# Altium schematic sheet UI_Ticketing_Master.SchDoc
size A4; Organization: ETML-ES; Address1: Avenue Recordon 1; Address2: 1004 Lausanne; Address3: Switzerland
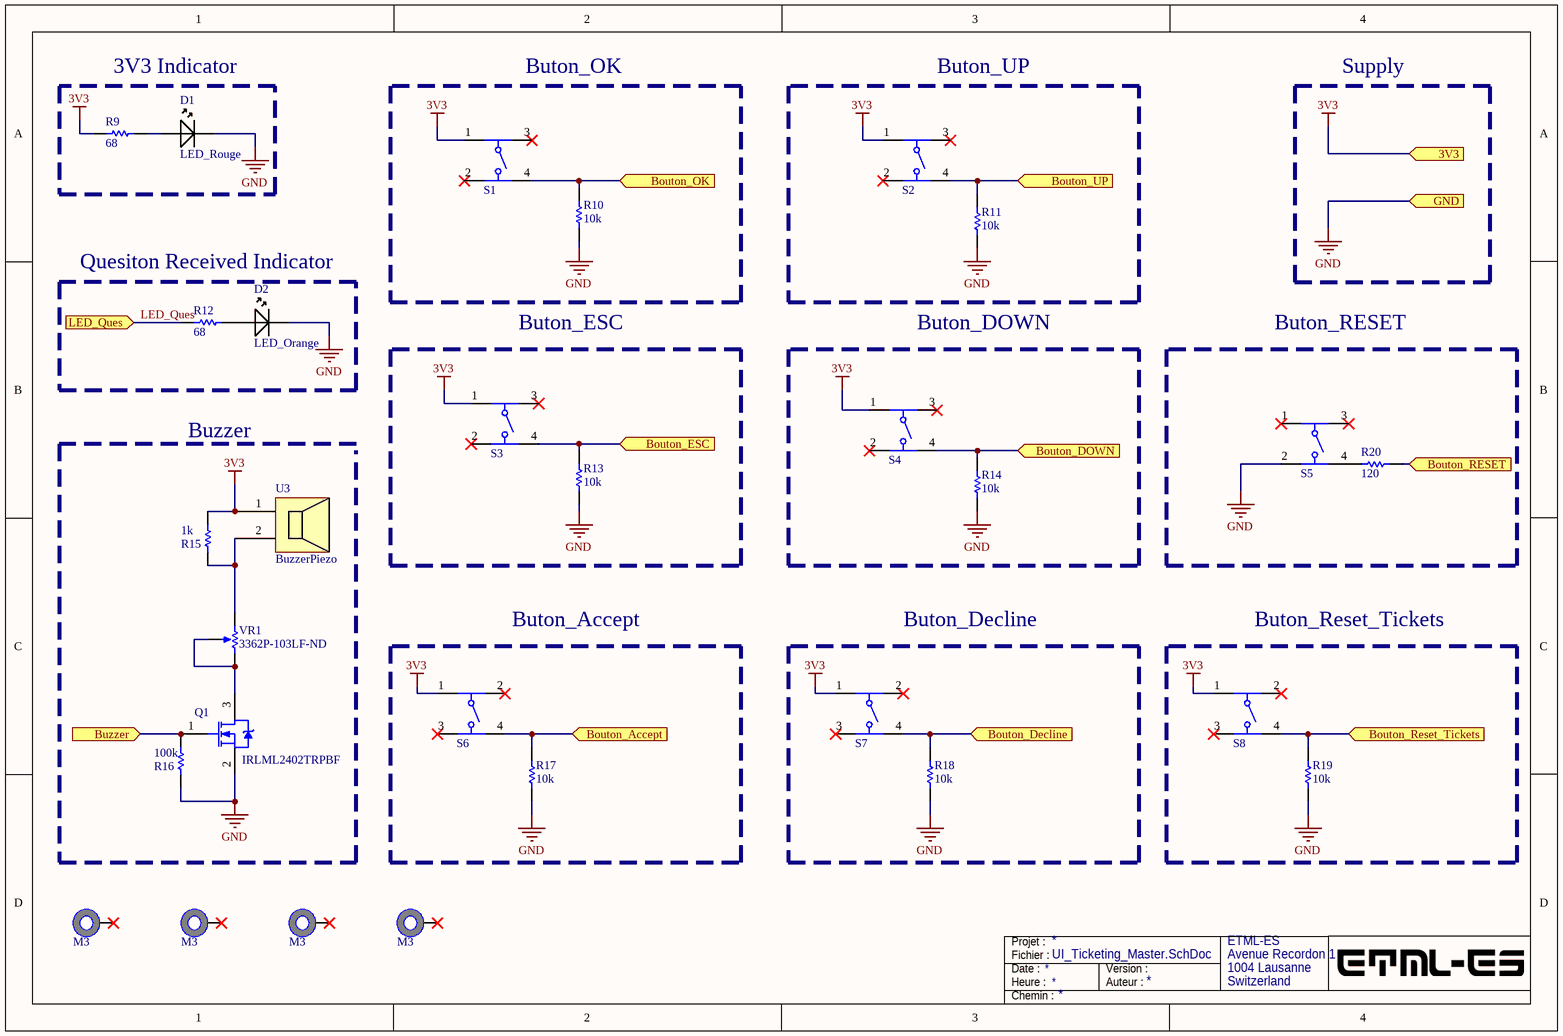
[diagram p0: UI_Ticketing_Master.SchDoc]

## Parts
(Parts that share a designator on the sheet are numbered #1, #2 ... from top to bottom, then left to right.)
?#1  M3  [9774010151]
?#2  M3  [9774010151]
?#3  M3  [9774010151]
?#4  M3  [9774010151]
D1  LED_Rouge  [LED-2P-2.28-3MM]
D2  LED_Orange  [Type 5mm]
Q1  IRLML2402TRPBF  [INTR-IRLML2402TRPBF-3_V]
R9  68  [RESC0805(2012)_L]
R10  10k  [RESC0805(2012)_L]
R11  10k  [RESC0805(2012)_L]
R12  68  [RESC0805(2012)_L]
R13  10k  [RESC0805(2012)_L]
R14  10k  [RESC0805(2012)_L]
R15  1k  [RESC2013X60X35ML10T20]
R16  100k  [RESC2013X60X35ML10T20]
R17  10k  [RESC0805(2012)_L]
R18  10k  [RESC0805(2012)_L]
R19  10k  [RESC0805(2012)_L]
R20  120  [RESC0805(2012)_L]
S1  430152095826  [430152095826]  (value not drawn)
S2  430152095826  [430152095826]  (value not drawn)
S3  430152095826  [430152095826]  (value not drawn)
S4  430152095826  [430152095826]  (value not drawn)
S5  430182050816  [430182050816]  (value not drawn)
S6  430466073726  [4304x60737x6_12x12x7.3]  (value not drawn)
S7  430466073726  [4304x60737x6_12x12x7.3]  (value not drawn)
S8  430466073726  [4304x60737x6_12x12x7.3]  (value not drawn)
U3  BuzzerPiezo  [Buzzer]
VR1  3362P-103LF-ND  [BOUR-3362P]

## Blocks framed on the sheet
3V3 Indicator: D1 R9
Buton_OK: R10 S1
Buton_UP: R11 S2
Quesiton Received Indicator: D2 R12
Buton_ESC: R13 S3
Buton_DOWN: R14 S4
Buton_RESET: R20 S5
Buton_Accept: R17 S6
Buton_Decline: R18 S7
Buton_Reset_Tickets: R19 S8

## Ports
3V3, Bouton_Accept, Bouton_Decline, Bouton_DOWN, Bouton_ESC, Bouton_OK, Bouton_RESET, Bouton_Reset_Tickets, Bouton_UP, Buzzer, GND, LED_Ques

## Nets
3V3: R9.2 R15.2 S1.1 S2.1 S3.1 S4.1 S6.1 S7.1 S8.1 U3.1 ; port 3V3
GND: D1.2(Cathode) D2.1(Cathode) Q1.2(S) R10.2 R11.2 R13.2 R14.2 R16.1 R17.2 R18.2 R19.2 S5.2 ; port GND
Bouton_Accept: R17.1 S6.4 ; port Bouton_Accept
Bouton_Decline: R18.1 S7.4 ; port Bouton_Decline
Bouton_DOWN: R14.1 S4.4 ; port Bouton_DOWN
Bouton_ESC: R13.1 S3.4 ; port Bouton_ESC
Bouton_OK: R10.1 S1.4 ; port Bouton_OK
Bouton_RESET: R20.2 ; port Bouton_RESET
Bouton_Reset_Tickets: R19.1 S8.4 ; port Bouton_Reset_Tickets
Bouton_UP: R11.1 S2.4 ; port Bouton_UP
Buzzer: Q1.1(G) R16.2 ; port Buzzer
LED_Ques: R12.2 ; port LED_Ques
NetD1_1: D1.1(Anode) R9.1
NetD2_2: D2.2(Anode) R12.1
NetQ1_3: Q1.3(D) VR1.2(S) VR1.3(CW)
NetR15_1: R15.1 U3.2 VR1.1(CCW)
NetR20_1: R20.1 S5.4

Not connected (* = marked no-connect by the designer): ?#1 1*; ?#2 1*; ?#3 1*; ?#4 1*; S1 2* 3*; S2 2* 3*; S3 2* 3*; S4 2* 3*; S5 1* 3*; S6 2* 3*; S7 2* 3*; S8 2* 3*

## Notes on the sheet
- Supply
- Buzzer
- Fichier :
- Date :
- Heure :
- Projet :
- Auteur :
- Version :
- Chemin :

## Library data of the parts
?#1-?#4 = 9774010151: WA-SMSI SMT Steel Spacer, M2.5 Thread Internal, Length 1mm; InnerDiameter: 3.5mm; OuterDiameter: 5.1mm; PublishedDate: Dec. 2016; Publisher: Wurth Elektronik; ComponentLink1Description: Manufacturer; ComponentLink1URL: http://www.we-online.de; ComponentLink2Description: Datasheet; ComponentLink2URL: http://katalog.we-online.de/em/datasheet/9774010151.pdf; PartNumber: 9774010151; Length: 1mm; Thread: M2.5; Packaging: Bulk
D1 D2 = LED: Supplier A: *; Supplier B: *; Supplier B Ref: *; Manufacturer URL: *; Manufacturer Ref: *; Package: *
  D1: Supplier A Ref: 754-1305-ND
  D2: Supplier A Ref: 754-1271-ND
Q1 = CMP-2000-05155-1: HEXFET(R) Power MOSFET, N-Channel, 20 V, 1.2 A, 3-Pin SOT-23, RoHS, Tape and Reel; Manufacturer: Infineon Technologies; PartNumber: IRLML2402TRBF; PackageCase: SOT-23; Supplier: Digi-key; Supplier PN: IRLML2402PBFCT-ND
R9-R14 R17-R19 = CMP-1013-00122-1: 100K 0.125W 5% 0805 (2012 Metric)  SMD; Case-Metric: 2012; Case-EIA: 0805; Tolerance: 5 %; Technology: SMT; Power: 0.125 W
  R9 R12: Value: 68
  R10 R11 R13 R14 R17-R19: Value: 10k
R15 = CMP-2100-03671-1: Chip Resistor, 1 KOhm, +/- 1%, 125 mW, -55 to 155 degC, 0805 (2012 Metric), RoHS, Tape and Reel; Voltage Rating: 150V; Value: 1kOhm; PackageCase: 0805
R16 = CMP-2100-03671-1: Chip Resistor, 100 KOhm, +/- 1%, 125 mW, -55 to 155 degC, 0805 (2012 Metric), RoHS, Tape and Reel; Voltage Rating: 150V; PackageCase: 0805; Value: 100k
R20 = CMP-1013-00122-1: 100K 0.125W 5% 0805 (2012 Metric)  SMD; Case-Metric: 2012; Value: 10k; Case-EIA: 0805; Tolerance: 5 %; Technology: SMT; Power: 0.125 W
S1-S4 = 430152095826: 6x6mm SMD Tact Switch WS-TASV, height 9.5 mm, 260 gf; Rated Current: 50 mA; Operation Force: 260 gf; Rated Voltage: 12 VDC; ComponentLink1Description: Manufacturer; ComponentLink1URL: http://www.we-online.de; ComponentLink2Description: Datasheet; ComponentLink2URL: http://katalog.we-online.de/em/datasheet/4301x2xxx8x6.pdf; Part Number: 430152095826; Published Date: Nov. 2017; Publisher: Wurth Elektronik; Life Cycle: 200000; Operating Temperature: -40 to +85 degC; Size: 6x6x9.5 mm
S5 = 430182050816: 6x6mm SMD Tact Switch WS-TASV, height 5 mm, 160 gf; Rated Current: 50 mA; Operation Force: 160 gf; Rated Voltage: 12 VDC; ComponentLink1Description: Manufacturer; ComponentLink1URL: http://www.we-online.de; ComponentLink2Description: Datasheet; ComponentLink2URL: http://katalog.we-online.de/em/datasheet/4301x2xxx8x6.pdf; Part Number: 430182050816; Published Date: Nov. 2017; Publisher: Wurth Elektronik; Life Cycle: 1000000; Operating Temperature: -40 to +85 degC; Size: 6x6x5 mm
S6-S8 = 430466073726: WS-TATV 12x12mm washable Tact Switch, THT version; Operation Force: 260g; ComponentLink1Description: Manufacturer; ComponentLink1URL: http://www.we-online.de; ComponentLink2Description: Datasheet; ComponentLink2URL: http://katalog.we-online.de/em/datasheet/4304x60737x6.pdf; Part Number: 430466073726; Published Date: June 2017; Publisher: Wurth Elektronik; Size: 12x12x7.3 mm; Life Cycle: 300000 cycles
U3 = BZR: Buzzer 12mm piezo; Manufacturer: TDK Corporation
VR1 = CMP-1747-00003-1: Square Trimpot(R) Trimming Potentiometer, 100 KOhm, 300 V, -55 to 125 degC, 3-Pin THD, RoHS, Tube; Voltage Rating: 250 V; Case\Package: Axial; Tolerance: 1%; Power Rating: 250 mW; Resistance: 1 mohm; RoHSCompliant: true; ComponentLink2URL: http://www.bourns.com/docs/Product-Datasheets/3362.pdf; ComponentLink1Description: Manufacturer URL; DatasheetVersion: May-16; Package Quantity: 200; ComponentLink2Description: Datasheet; Min Operating Temperature: -55 degC; Mount: Through Hole; PackageDescription: 3-Pin Through Hole Device, Body 6.6 x 6.99 mm, Pitch 2.54 mm; Length: 0.248 inch; ComponentLink1URL: http://www.bourns.com/; PackageReference: 3326P; Max Operating Temperature: 155 degC; Packaging: Bulk